# EAGLE design CoderDojo Controller (EAGLE 7.7.0)
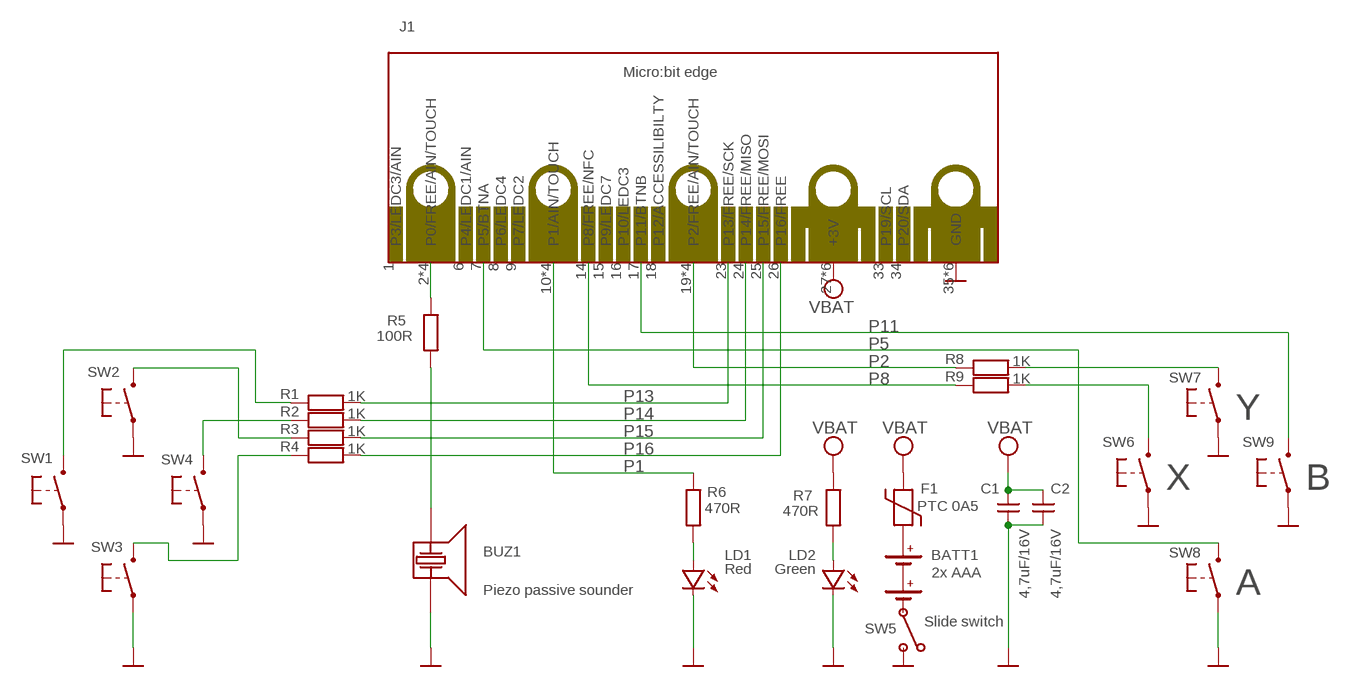
[diagram p0: schematic, sheet 1]

## Parts
BATT1  CJ2XAAA  [SOCKET_2XAAA]
BUZ1  CBUZ9  [BUZZER9]
C1  CC4U7A  [CAP_1206]
C2  CC4U7A  [CAP_1206]
F1  CFPOLY0A5B  [RES_1812]
J1  CJMBITH  [SOCKET_MBIT_H]
LD1  CDLEDRDC  [LED_0805]
LD2  CDLEDGNC  [LED_0805]
R1  CR1KA  [RES_0805]
R2  CR1KA  [RES_0805]
R3  CR1KA  [RES_0805]
R4  CR1KA  [RES_0805]
R5  CR100RA  [RES_0805]
R6  CR470RA  [RES_0805]
R7  CR470RA  [RES_0805]
R8  CR1KA  [RES_0805]
R9  CR1KA  [RES_0805]
SW1  CSWPUSHA5  [SWITCH_PUSH_5MM]
SW2  CSWPUSHA5  [SWITCH_PUSH_5MM]
SW3  CSWPUSHA5  [SWITCH_PUSH_5MM]
SW4  CSWPUSHA5  [SWITCH_PUSH_5MM]
SW5  CSWSS12F23  [SWITCH_SS12F23]
SW6  CSWPUSHA5  [SWITCH_PUSH_5MM]
SW7  CSWPUSHA5  [SWITCH_PUSH_5MM]
SW8  CSWPUSHA5  [SWITCH_PUSH_5MM]
SW9  CSWPUSHA5  [SWITCH_PUSH_5MM]

## Nets
GND: BUZ1.2 C1.1 C2.1 J1.35(GND) J1.36(GND) J1.37(GND) J1.38(GND) J1.39(GND) J1.40(GND) LD1.C LD2.C SW1.3(P) SW1.4(P) SW2.3(P) SW2.4(P) SW3.3(P) SW3.4(P) SW4.3(P) SW4.4(P) SW5.3(B) SW6.3(P) SW6.4(P) SW7.3(P) SW7.4(P) SW8.3(P) SW8.4(P) SW9.3(P) SW9.4(P)
N$1: R9.2 SW6.1(S) SW6.2(S)
N$4: R8.2 SW7.1(S) SW7.2(S)
N$6: R2.1 SW4.1(S) SW4.2(S)
N$7: R3.1 SW2.1(S) SW2.2(S)
N$9: J1.2(P0/FREE/AIN/TOUCH) J1.3(P0/FREE/AIN/TOUCH) J1.4(P0/FREE/AIN/TOUCH) J1.5(P0/FREE/AIN/TOUCH) R5.2
N$10: BUZ1.1 R5.1
N$11: BATT1.POS(+) F1.1
N$12: BATT1.NEG(-) SW5.2(CEN)
N$13: LD2.A R7.1
N$14: LD1.A R6.1
N$15: R1.1 SW1.1(S) SW1.2(S)
N$16: R4.1 SW3.1(S) SW3.2(S)
P1: J1.10(P1/AIN/TOUCH) J1.11(P1/AIN/TOUCH) J1.12(P1/AIN/TOUCH) J1.13(P1/AIN/TOUCH) R6.2
P2: J1.19(P2/FREE/AIN/TOUCH) J1.20(P2/FREE/AIN/TOUCH) J1.21(P2/FREE/AIN/TOUCH) J1.22(P2/FREE/AIN/TOUCH) R8.1
P5: J1.7(P5/BTNA) SW8.1(S) SW8.2(S)
P8: J1.14(P8/FREE/NFC) R9.1
P11: J1.17(P11/BTNB) SW9.1(S) SW9.2(S)
P13: J1.23(P13/FREE/SCK) R1.2
P14: J1.24(P14/FREE/MISO) R2.2
P15: J1.25(P15/FREE/MOSI) R3.2
P16: J1.26(P16/FREE) R4.2
VBAT: C1.2 C2.2 F1.2 J1.27(+3V) J1.28(+3V) J1.29(+3V) J1.30(+3V) J1.31(+3V) J1.32(+3V) R7.2 ; supply symbol labelled SUPPLY_VBAT
Unconnected: J1.1(P3/LEDC3/AIN) J1.6(P4/LEDC1/AIN) J1.8(P6/LEDC4) J1.9(P7/LEDC2) J1.15(P9/LEDC7) J1.16(P10/LEDC3) J1.18(P12/ACCESSILIBILTY) J1.33(P19/SCL) J1.34(P20/SDA) SW5.1(A)

## Notes on the sheet
- Y
- X | B
- Piezo passive sounder | A

## Library data of the parts
BATT1 = d2s_new:CJ2XAAA: Battery holder 2x AAA Estimated price: 0.000000 EUR; ESTIMATED_PRICE: 0.000000; VALUE_SHOWN: 2x AAA
BUZ1 = d2s_new:CBUZ9: Passive piezo sounder 3-5v Estimated price: 0.000000 EUR; ESTIMATED_PRICE: 0.000000; SUPPLIER_1: Aliexpress; VALUE_SHOWN: Buzzer
C1 C2 = d2s_new:CC4U7A: Capacitor ceramic 4u7 / 16V / SMD 1206 / Y5V (NEW VERSION: 50V) Estimated price: 0.021600 EUR; ESTIMATED_PRICE: 0.021600; SUPPLIER_1: Farnell; SUPPLIER_1_REF: 1759444; VALUE_SHOWN: 4,7uF/16V
F1 = d2s_new:CFPOLY0A5B: Polyfuse 30V/500mA Estimated price: 0.169000 EUR; ESTIMATED_PRICE: 0.169000; SUPPLIER_1: Aliexpress; VALUE_SHOWN: PTC 0A5
J1 = d2s_new:CJMBITH: Micro:bit edge connectie Estimated price: 0.000000 EUR; ESTIMATED_PRICE: 0.000000; VALUE_SHOWN: Micro:bit edge
LD1 = d2s_new:CDLEDRDC: Led Red 625nm / 120 deg / 20mA / 2V / SMD 0805 Estimated price: 0.004500 EUR; ESTIMATED_PRICE: 0.004500; SUPPLIER_1: Farnell; SUPPLIER_1_REF: 2099236; VALUE_SHOWN: Red
LD2 = d2s_new:CDLEDGNC: Led Green 568nm / 120 deg / 20mA / 2,2V / SMD 0805 Estimated price: 0.004300 EUR; ESTIMATED_PRICE: 0.004300; SUPPLIER_1: Farnell; SUPPLIER_1_REF: 2099239; VALUE_SHOWN: Green
R1-R4 R8 R9 = d2s_new:CR1KA: 1K / 1% / 0,1W / 0805 Estimated price: 0.001200 EUR; ESTIMATED_PRICE: 0.001200; SUPPLIER_1: Farnell; SUPPLIER_1_REF: 9332383; VALUE_SHOWN: 1K
R5 = d2s_new:CR100RA: 100R / 1% / 0,1W / 0805 Estimated price: 0.001400 EUR; ESTIMATED_PRICE: 0.001400; SUPPLIER_1: Farnell; SUPPLIER_1_REF: 9332375; VALUE_SHOWN: 100R
R6 R7 = d2s_new:CR470RA: 470R / 1% / 0,1W / 0805 Estimated price: 0.001500 EUR; ESTIMATED_PRICE: 0.001500; SUPPLIER_1: Farnell; SUPPLIER_1_REF: 9333258; VALUE_SHOWN: 470R
SW1-SW4 SW6-SW9 = d2s_new:CSWPUSHA5: drukknop (on)-off 6x6mm print height 5mm Estimated price: 0.170000 EUR; ESTIMATED_PRICE: 0.170000; SUPPLIER_1: Aliexpress; VALUE_SHOWN: Pushbutton
SW5 = d2s_new:CSWSS12F23: 50v/0,5A spdt Estimated price: 0.000000 EUR; ESTIMATED_PRICE: 0.000000; SUPPLIER_1: Aliexpress; VALUE_SHOWN: Slide switch

## Board
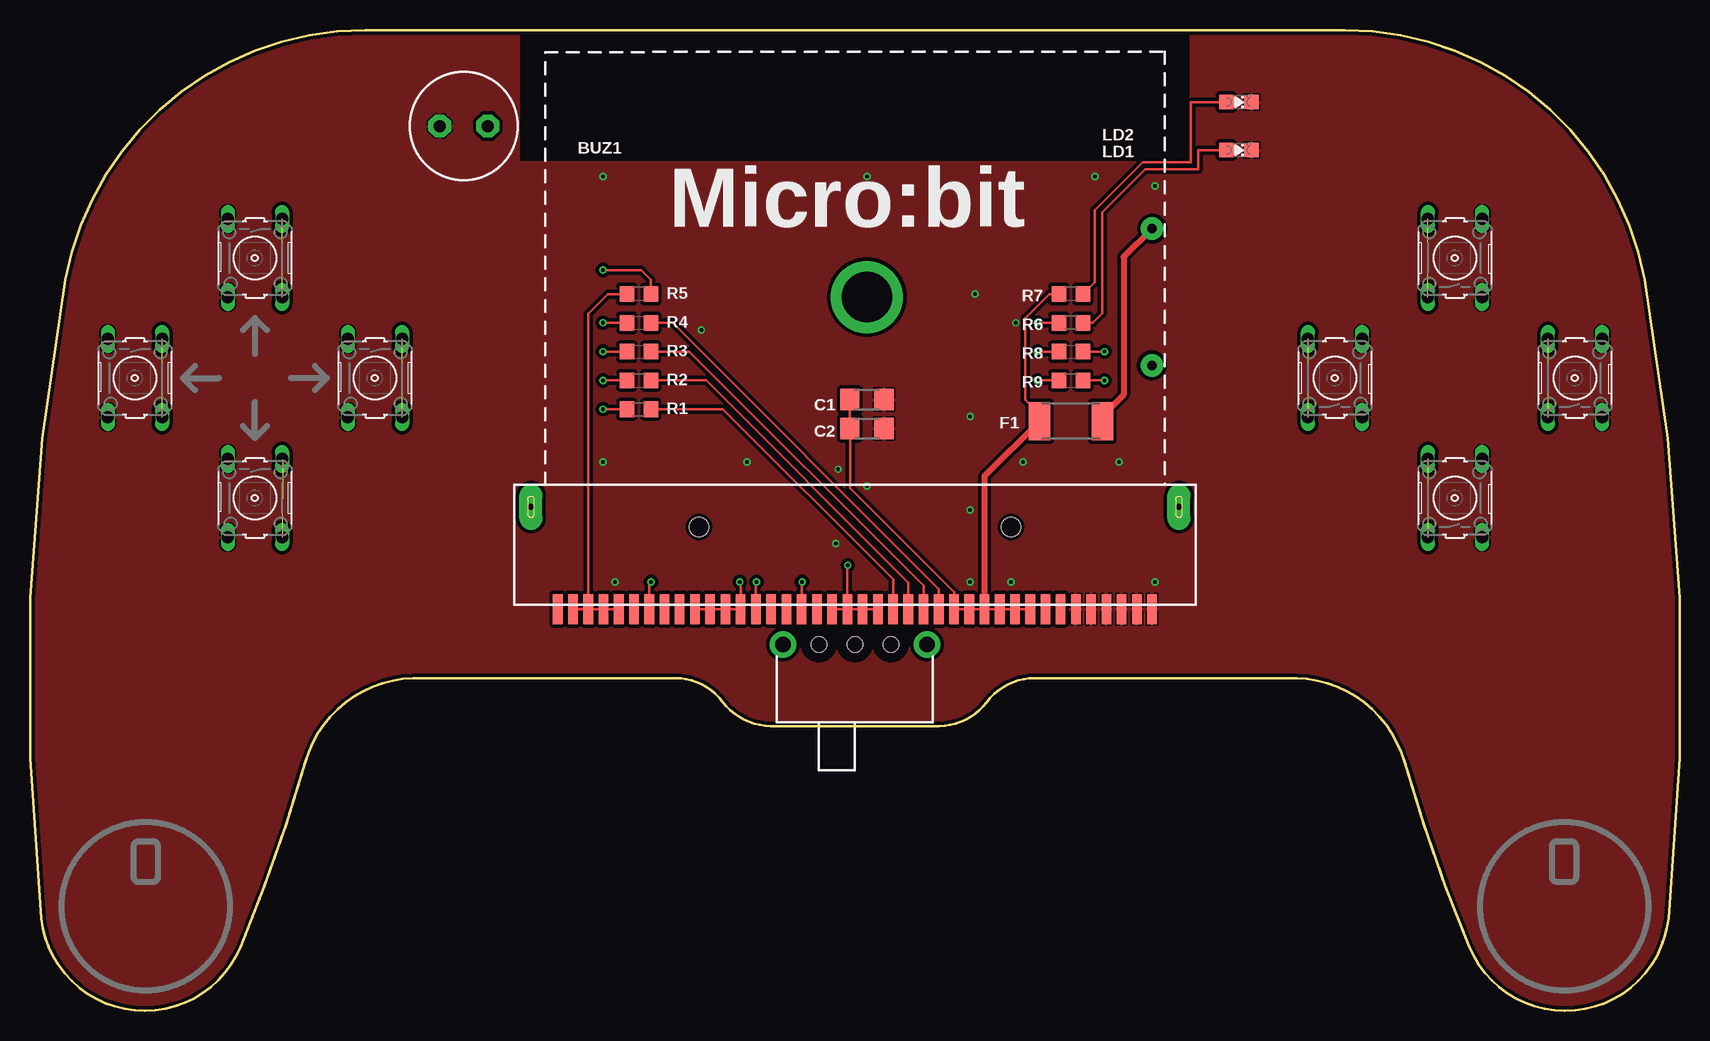
[diagram p1: board, top side]
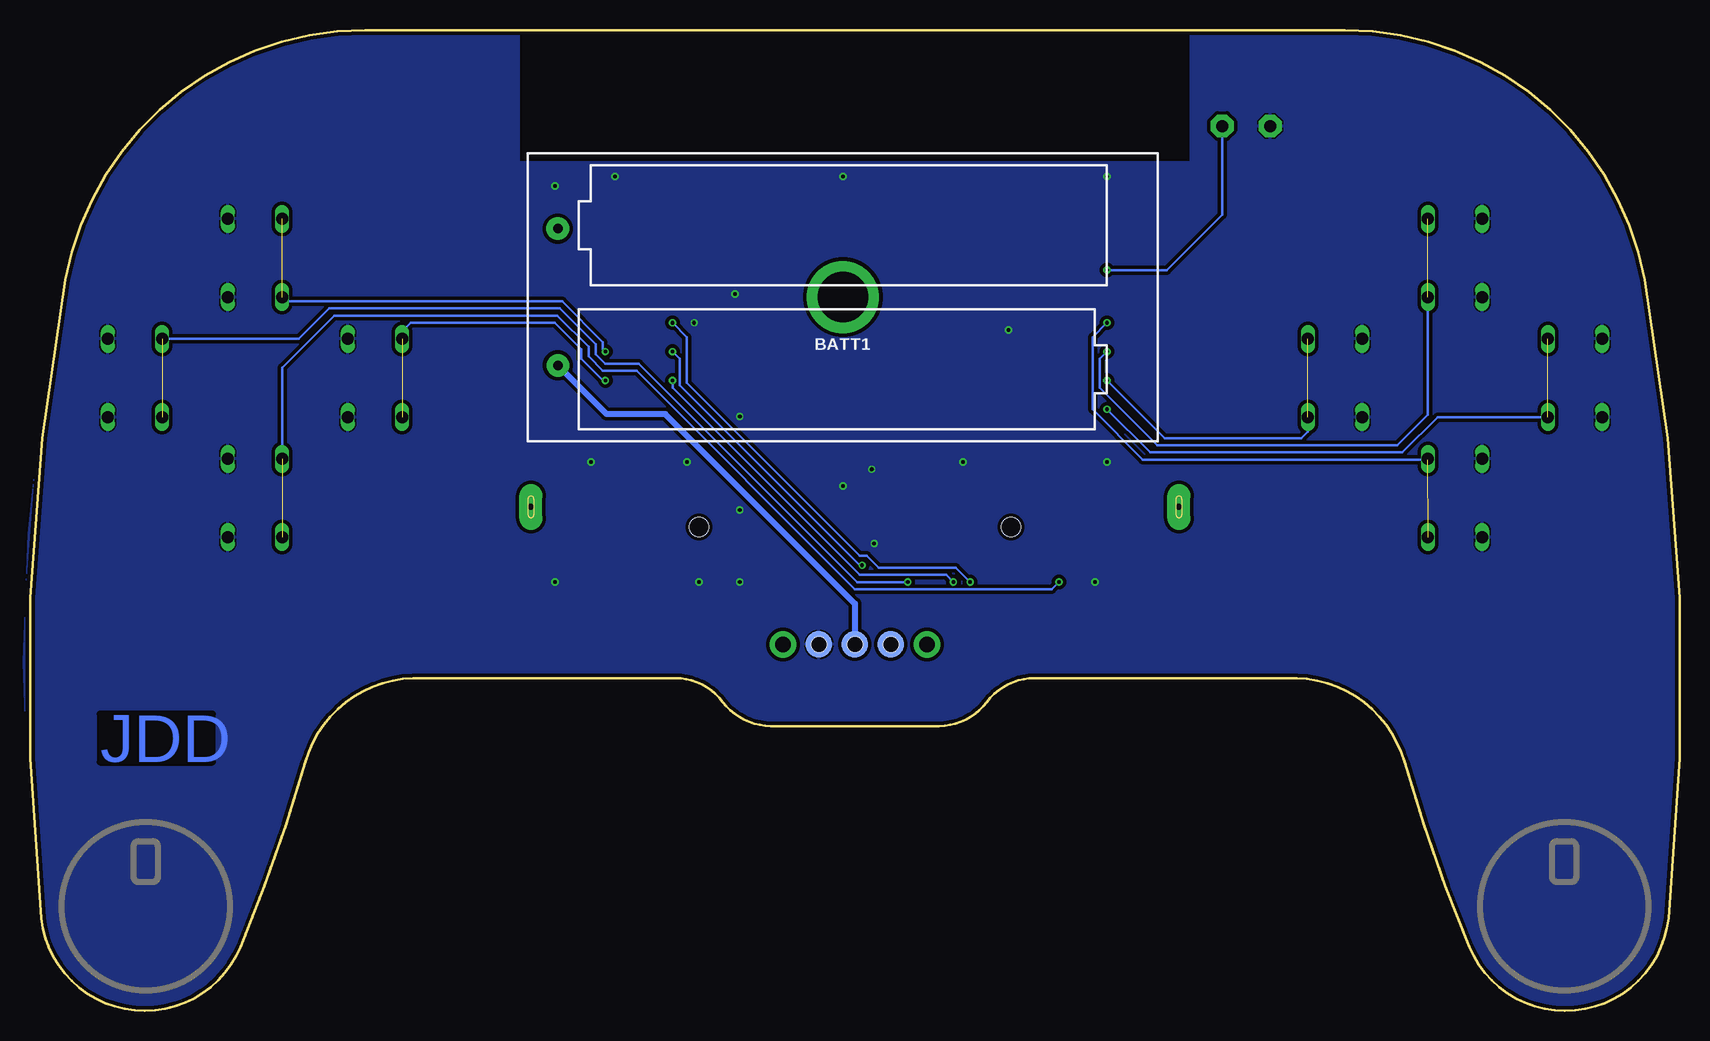
[diagram p2: board, bottom side, seen from below]

Size 137.49 x 81.74 mm. Coordinates in mm from the lower left corner, seen from the top.
Outline: 27.95,81.74 arc80 2.95,60.94 arc17 0.95,7.74 arc151 17.55,5.34 arc6 22.95,20.74 arc-72 31.95,27.74 53.75,27.74 arc-53 57.75,25.74 arc53 61.75,23.74 75.75,23.74 arc53 79.75,25.74 arc-53 83.75,27.74 105.55,27.74 arc-72 114.55,20.74 arc6 119.95,5.34 arc151 136.55,7.74 arc17 134.55,60.94 arc80 109.55,81.74 27.95,81.74
Copper layers (1*16): Top 0.035mm / dielectric 1.55mm / Bottom 0.035mm
Design rules "JLC 2 layer standard": minimum track width 5mil, minimum drill 0.3mm, track to track 5mil, track to pad 5mil, pad to pad 5mil, via to via 5mil, smd to smd 5mil, copper to edge 0.3mm, drill to drill 0.3mm, minimum pad ring 3mil, minimum via ring 3mil, stop-mask expansion 0.1mm, vias tented up to drill 0.5mm, thermal gap 0.15mm

### Footprints (pad centres in the part's own frame; a part is rotated, then mirrored left to right if it is on the bottom)
SOCKET_2XAAA = drill 0.8 pad 1.9: NEG 23.75,5.7; POS 23.758,-5.7 | drill 4.2 pad 6: NUT 0,0
BUZZER9 = drill 1 pad 1.9 octagon: 1 -2,0; 2 2,0
CAP_1206 = smd 1.6 x 1.803: 1 -1.422,0; 2 1.422,0
RES_1812 = smd 1.8 x 3.2: 1 -2.62,0; 2 2.62,0
SOCKET_MBIT_H = smd 0.8 x 2.5: 1 -24.765,-6.85; 2 -23.495,-6.85; 3 -22.225,-6.85; 4 -20.955,-6.85; 5 -19.685,-6.85; 6 -18.415,-6.85; 7 -17.145,-6.85; 8 -15.875,-6.85; 9 -14.605,-6.85; 10 -13.335,-6.85; 11 -12.065,-6.85; 12 -10.795,-6.85; 13 -9.525,-6.85; 14 -8.255,-6.85; 15 -6.985,-6.85; 16 -5.715,-6.85; 17 -4.445,-6.85; 18 -3.175,-6.85; 19 -1.905,-6.85; 20 -0.635,-6.85; 21 0.635,-6.85; 22 1.905,-6.85; 23 3.175,-6.85; 24 4.445,-6.85; 25 5.715,-6.85; 26 6.985,-6.85; 27 8.255,-6.85; 28 9.525,-6.85; 29 10.795,-6.85; 30 12.065,-6.85; 31 13.335,-6.85; 32 14.605,-6.85; 33 15.875,-6.85; 34 17.145,-6.85; 35 18.415,-6.85; 36 19.685,-6.85; 37 20.955,-6.85; 38 22.225,-6.85; 39 23.495,-6.85; 40 24.765,-6.85 | drill 0.5 pad 1.9 long: P$1 27,1.66; P$2 -27,1.66 | hole 1.6: -13,0; 13,0
LED_0805 = smd 1.2 x 1.2: A -1.05,0; C 1.05,0
RES_0805 = smd 1.2 x 1.3: 1 -1,0; 2 1,0
SWITCH_PUSH_5MM = drill 1 long: 1 -3.251,2.261; 2 3.251,2.261; 3 -3.251,-2.261; 4 3.251,-2.261
SWITCH_SS12F23 = smd 2.2 x 2.2 bottom: 1 -3,0; 2 0,0; 3 3,0 | drill 1.3 pad 2.2: CASE1 -6,0; CASE2 6,0 | hole 1.3: -3,0; 0,0; 3,0

### Placement (x,y rotation side)
BATT1  69.75,59.49 180 bottom
BUZ1  36.15,73.74 180 top
C1  69.75,48.54 180 top
C2  69.75,50.94 180 top
F1  86.75,49.14 180 top
J1  68.75,40.34 0 top
LD1  100.75,71.74 0 top
LD2  100.75,75.74 0 top
R1  50.75,50.14 0 top
R2  50.75,52.54 0 top
R3  50.75,54.94 0 top
R4  50.75,57.34 0 top
R5  50.75,59.74 180 top
R6  86.75,57.34 180 top
R7  86.75,59.74 180 top
R8  86.75,54.94 0 top
R9  86.75,52.54 0 top
SW1  8.75,52.74 270 top
SW2  18.75,62.74 270 top
SW3  18.75,42.74 270 top
SW4  28.75,52.74 270 top
SW5  68.75,30.54 0 top
SW6  108.75,52.74 90 top
SW7  118.75,62.74 90 top
SW8  118.75,42.74 90 top
SW9  128.75,52.74 90 top

### Tracks (layer width: path | path; a pad name or v marks a point on that pad's centre or on a via)
GND  (via drill 0.3 pad 0.6)
  other vias: 47.75,45.74 48.75,35.74 67.15,38.94 59.75,45.74 69.75,43.74 93.75,35.74 90.75,45.74 78.35,49.54 82.75,45.74 69.75,69.54 82.15,57.34 78.75,59.74 93.75,68.74 47.75,69.54 81.75,35.74 55.95,56.74 88.75,69.54 78.35,41.74 78.35,35.74 67.35,45.14
  pour Top (isolate 0.3): 109.75,81.74 96.75,81.74 96.75,70.74 40.75,70.74 40.75,81.74 27.95,81.74 arc80 2.95,60.94 arc17 0.95,7.74 arc151 17.55,5.34 arc6 22.95,20.74 arc-72 31.95,27.74 53.75,27.74 arc-53 57.75,25.74 arc53 61.75,23.74 75.75,23.74 arc53 79.75,25.74 arc-53 83.75,27.74 105.55,27.74 arc-76 114.55,20.74 arc10 119.95,5.34 arc148 136.55,7.74 arc20 134.55,60.94 arc75
  pour Bottom (isolate 0.3): 109.75,81.74 96.75,81.74 96.75,70.74 40.75,70.74 40.75,81.74 27.95,81.74 arc80 2.95,60.94 arc17 0.95,7.74 arc151 17.55,5.34 arc6 22.95,20.74 arc-72 31.95,27.74 53.75,27.74 arc-53 57.75,25.74 arc53 61.75,23.74 75.75,23.74 arc53 79.75,25.74 arc-53 83.75,27.74 105.55,27.74 arc-76 114.55,20.74 arc10 119.95,5.34 arc148 136.55,7.74 arc20 134.55,60.94 arc75
N$1  (via drill 0.3 pad 0.6)  (1 unrouted)
  Top 0.2: R9.2 v89.55,52.54
  Bottom 0.2: v89.55,52.54 89.75,52.54 91.55,54.34 91.55,55.14 93.75,57.34 105.75,57.34 106.48,56.6 SW6.2
N$4  (via drill 0.3 pad 0.6)  (1 unrouted)
  Top 0.2: R8.2 v89.55,54.94
  Bottom 0.2: v89.55,54.94 89.75,55.14 89.75,55.74 93.15,59.14 116.15,59.14 SW7.1
N$6  (via drill 0.3 pad 0.6)  (1 unrouted)
  Top 0.2: R2.1 v47.75,52.54
  Bottom 0.2: SW4.2 31.01,48.28 31.55,47.74 42.95,47.74 v47.75,52.54
N$7  (via drill 0.3 pad 0.6)  (1 unrouted)
  Top 0.2: R3.1 v47.75,54.94
  Bottom 0.2: SW2.2 21.01,49.68 23.55,47.14 43.55,47.14 48.35,51.94 48.35,54.34 v47.75,54.94
N$9
  Top 0.2: R5.2 48.15,59.74 46.52,58.11 J1.3 | J1.2 J1.3 | J1.3 J1.4 J1.5
N$10  (via drill 0.3 pad 0.6)
  Top 0.2: v47.75,61.74 50.95,61.74 51.75,60.94 R5.1
  Bottom 0.2: BUZ1.1 38.15,66.34 42.75,61.74 v47.75,61.74
N$11
  Top 0.5: F1.1 89.37,49.56 91.15,51.34 91.15,62.83 BATT1.POS
N$12
  Bottom 0.5: SW5.2 68.75,33.94 84.55,49.74 89.45,49.74 BATT1.NEG
N$13
  Top 0.2: LD2.A 96.75,75.74 96.75,70.74 92.75,70.74 88.75,66.74 88.75,60.74 R7.1
N$14
  Top 0.2: LD1.A 97.35,71.74 97.35,70.14 92.95,70.14 89.35,66.54 89.35,58.14 88.55,57.34 R6.1
N$15  (via drill 0.3 pad 0.6)  (1 unrouted)
  Top 0.2: R1.1 v47.75,50.14
  Bottom 0.2: v47.75,50.14 44.15,46.54 23.15,46.54 20.2,49.49 SW1.2
N$16  (via drill 0.3 pad 0.6)  (1 unrouted)
  Top 0.2: R4.1 v47.75,57.34
  Bottom 0.2: v47.75,57.34 48.95,56.14 48.95,50.14 44.75,45.94 21.06,45.94 SW3.1
P1  (via drill 0.3 pad 0.6)
  Top 0.2: J1.10 J1.11 J1.12 J1.13 59.22,35.66 v59.15,35.74 | R6.2 v83.95,57.34
  Bottom 0.2: v83.95,57.34 82.75,56.14 82.75,52.34 68.35,37.94 67.75,37.94 66.75,36.94 60.35,36.94 v59.15,35.74
P2  (via drill 0.3 pad 0.6)
  Top 0.2: J1.20 J1.21 J1.22 | J1.19 J1.20 | R8.1 v83.95,54.94 | v68.15,37.14 68.11,37.1 J1.20
  Bottom 0.2: v83.95,54.94 83.35,54.34 83.35,52.14 68.35,37.14 v68.15,37.14
P5  (via drill 0.3 pad 0.6)  (1 unrouted)
  Top 0.2: v51.75,35.74 51.6,35.59 J1.7
  Bottom 0.2: SW8.2 116.48,53.6 112.15,57.94 93.55,57.94 90.95,55.34 90.95,54.54 89.75,53.34 86.95,53.34 68.75,35.14 52.35,35.14 v51.75,35.74
P8  (via drill 0.3 pad 0.6)
  Top 0.2: R9.1 v83.95,52.54 | v60.55,35.74 60.49,35.68 J1.14
  Bottom 0.2: v83.95,52.54 83.95,51.94 68.35,36.34 61.15,36.34 v60.55,35.74
P11  (via drill 0.3 pad 0.6)  (1 unrouted)
  Top 0.2: v64.35,35.74 64.3,35.69 J1.17
  Bottom 0.2: SW9.2 115.09,55.99 112.55,58.54 93.35,58.54 90.35,55.54 90.35,54.74 89.55,53.94 86.75,53.94 68.55,35.74 v64.35,35.74
P13
  Top 0.2: J1.23 71.92,35.96 57.75,50.14 R1.2
P14
  Top 0.2: J1.24 73.19,35.69 56.35,52.54 R2.2
P15
  Top 0.2: J1.25 74.46,35.42 54.95,54.94 R3.2
P16
  Top 0.2: J1.26 75.73,35.15 53.55,57.34 R4.2
VBAT
  Top 0.2: J1.32 J1.31 J1.30 J1.29 J1.28 J1.27 77,34.88 68.35,43.54 68.35,48.51 C1.2 68.32,50.31 68.35,50.34 68.35,50.91 C2.2 | R7.2 84.95,59.74 82.95,57.74 82.95,50.94 84.13,49.76 F1.2
  Top 0.5: J1.29 79.54,44.55 F1.2

### Text on the board
Bottom: JDD
tDocu: Y | X | B | A | OFF | ON
bDocu: 2x AAA